# EAGLE design boards3 (EAGLE 7.0.0)
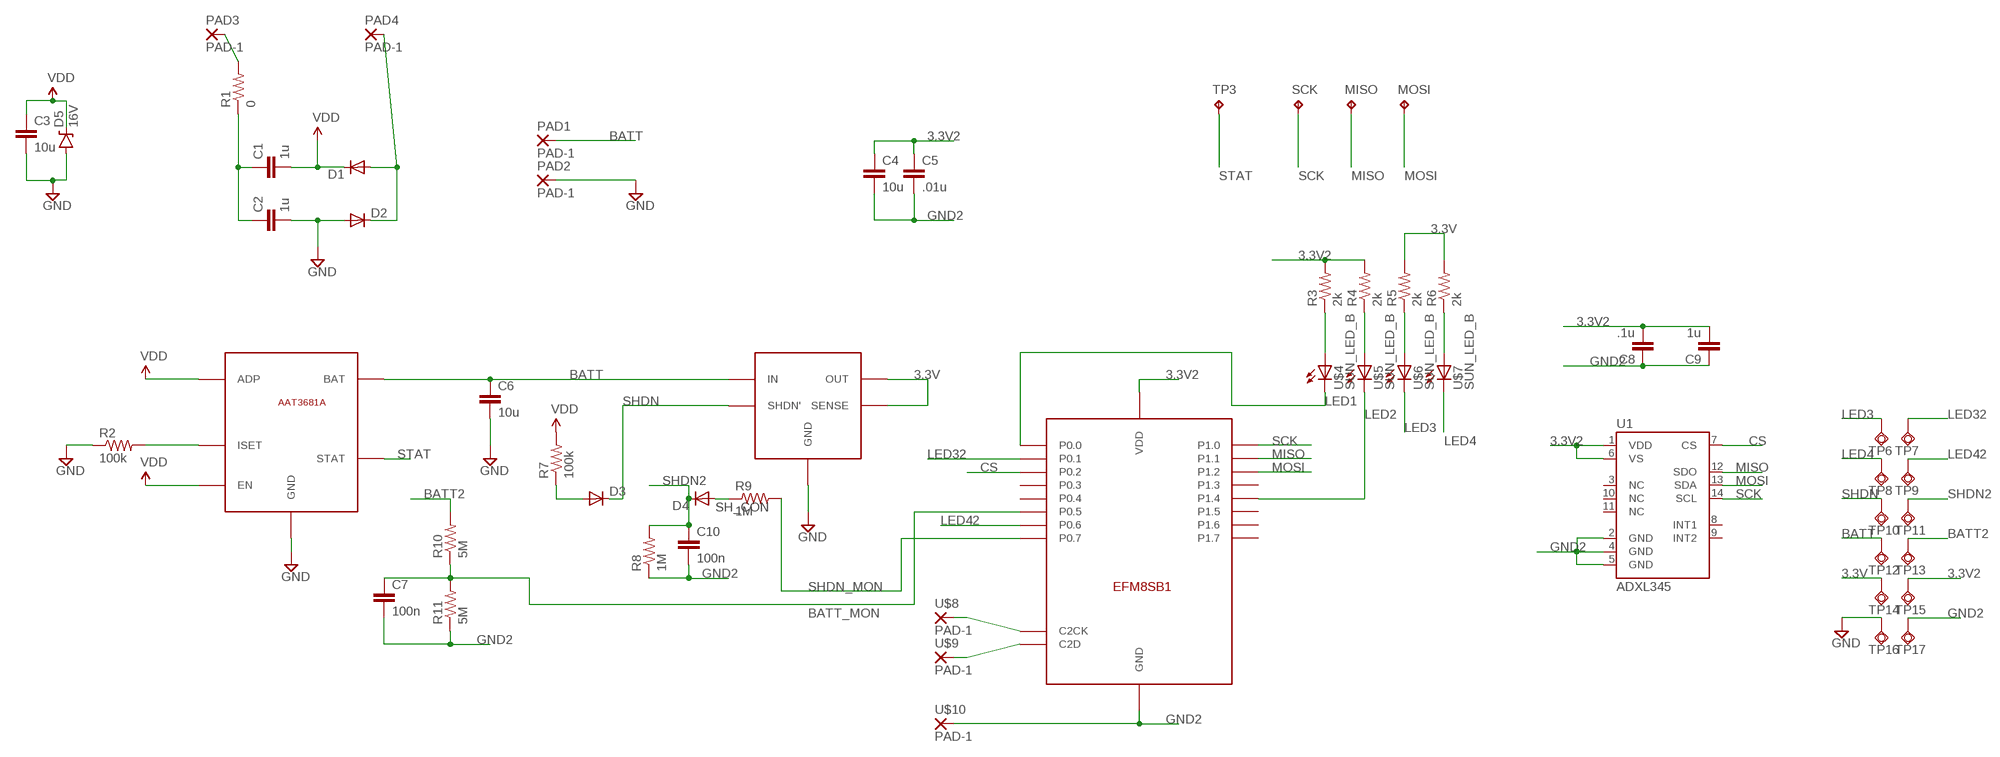
[diagram p0: schematic, sheet 1]

## Parts
C1  1u  CAP0402-CAP  [0402-CAP]
C2  1u  CAP0402-CAP  [0402-CAP]
C3  10u  CAP0603-CAP  [0603-CAP]
C4  10u  CAP0603-CAP  [0603-CAP]
C5  .01u  CAP0402-CAP  [0402-CAP]
C6  10u  CAP0603-CAP  [0603-CAP]
C7  100n  CAP0402-CAP  [0402-CAP]
C8  .1u  CAP0402-CAP  [0402-CAP]
C9  1u  CAP0402-CAP  [0402-CAP]
C10  100n  CAP0402-CAP  [0402-CAP]
D1  DIODE-SOD323-W  [SOD323-W]
D2  DIODE-SOD323-W  [SOD323-W]
D3  DIODE-SOD323-W  [SOD323-W]
D4  DIODE-SOD323-W  [SOD323-W]
D5  16V  DIODE-ZENER16V  [SOD-123]
MISO  TPB1,27  [B1,27]
MOSI  TPB1,27  [B1,27]
PAD1  PAD-1  [PAD]
PAD2  PAD-1  [PAD]
PAD3  PAD-1  [PAD]
PAD4  PAD-1  [PAD]
R1  0  RESISTOR0402-RES  [0402-RES]
R2  100k  RESISTOR0402-RES  [0402-RES]
R3  2k  RESISTOR0402-RES  [0402-RES]
R4  2k  RESISTOR0402-RES  [0402-RES]
R5  2k  RESISTOR0402-RES  [0402-RES]
R6  2k  RESISTOR0402-RES  [0402-RES]
R7  100k  RESISTOR0402-RES  [0402-RES]
R8  1M  RESISTOR0402-RES  [0402-RES]
R9  1M  RESISTOR0402-RES  [0402-RES]
R10  5M  RESISTOR0402-RES  [0402-RES]
R11  5M  RESISTOR0402-RES  [0402-RES]
SCK  TPB1,27  [B1,27]
TP3  TPB1,27  [B1,27]
TP6  TPSQB1,27  [B1,27]
TP7  TPSQB1,27  [B1,27]
TP8  TPSQB1,27  [B1,27]
TP9  TPSQB1,27  [B1,27]
TP10  TPSQB1,27  [B1,27]
TP11  TPSQB1,27  [B1,27]
TP12  TPSQB1,27  [B1,27]
TP13  TPSQB1,27  [B1,27]
TP14  TPSQB1,27  [B1,27]
TP15  TPSQB1,27  [B1,27]
TP16  TPSQB1,27  [B1,27]
TP17  TPSQB1,27  [B1,27]
U1  ADXL345  [LGA14]
U$1  AAT3681A  [SC70JW-8]
U$2  EFM8SB1  [EFM8SB1]
U$3  LT3008  [TSOT23-8]
U$4  SUN_LED_B  [1209]
U$5  SUN_LED_B  [1209]
U$6  SUN_LED_B  [1209]
U$7  SUN_LED_B  [1209]
U$8  PAD-1  [PAD]
U$9  PAD-1  [PAD]
U$10  PAD-1  [PAD]

## Nets
3.3V: R5.2 R6.2 TP14.TP U$3.6(OUT) U$3.7(SENSE)
3.3V2: C4.1 C5.1 C8.2 C9.2 R3.2 R4.2 TP15.TP U1.1(VDD) U1.6(VS) U$2.3(VDD)
BATT: C6.1 PAD1.P$1(P) TP12.TP U$1.3(BAT) U$3.5(IN)
BATT2: R10.2 TP13.TP
BATT_MON: C7.1 R10.1 R11.2 U$2.19(P0.5)
C2CK: U$2.6(C2CK) U$8.P$1(P)
C2D: U$2.7(C2D) U$9.P$1(P)
CS: U1.7(CS) U$2.22(P0.2)
GND: C2.2 C3.2 C6.2 D2.A D5.A PAD2.P$1(P) R2.1 TP16.TP U$1.6(GND) U$1.7(GND) U$1.8(GND) U$3.2(GND) U$3.3(GND) U$3.4(GND)
GND2: C4.2 C5.2 C7.2 C8.1 C9.1 C10.2 R8.1 R11.1 TP17.TP U1.2(GND) U1.4(GND) U1.5(GND) U$2.2(GND) U$10.P$1(P)
LED1: U$2.24(P0.0) U$4.C
LED2: U$2.12(P1.4) U$5.C
LED3: TP6.TP U$6.C
LED4: TP8.TP U$7.C
LED32: TP7.TP U$2.23(P0.1)
LED42: TP9.TP U$2.18(P0.6)
MISO: MISO.TP U1.12(SDO) U$2.15(P1.1)
MOSI: MOSI.TP U1.13(SDA) U$2.14(P1.2)
N$1: R2.2 U$1.2(ISET)
N$2: R3.1 U$4.A
N$3: D3.A R7.1
N$4: R4.1 U$5.A
N$10: R5.1 U$6.A
N$15: R6.1 U$7.A
N$16: C1.1 C2.1 R1.1
N$19: D1.A D2.C PAD4.P$1(P)
N$20: PAD3.P$1(P) R1.2
SCK: SCK.TP U1.14(SCL) U$2.16(P1.0)
SH_CON: D4.A R9.1
SHDN: D3.C TP10.TP U$3.1(SHDN')
SHDN2: C10.1 D4.C R8.2 TP11.TP
SHDN_MON: R9.2 U$2.17(P0.7)
STAT: TP3.TP U$1.5(STAT)
VDD: C1.2 C3.1 D1.C D5.C R7.2 U$1.1(EN) U$1.4(ADP)
Unconnected: U1.3(NC) U1.8(INT1) U1.9(INT2) U1.10(NC) U1.11(NC) U$2.8(P1.7) U$2.9(P1.6) U$2.11(P1.5) U$2.13(P1.3) U$2.20(P0.4) U$2.21(P0.3)

## Library data of the parts
C1-C10 = SparkFun-Passives:CAP: Capacitor Standard 0603 ceramic capacitor, and 0.1" leaded capacitor.
D1-D4 = diode:DIODE-: DIODE
D5 = SparkFun-DiscreteSemi:DIODE-ZENER: Zener Diode Production Part - 8199 3.4V Zener Voltage; PROD_ID: DIO-12440
MISO MOSI SCK TP3 = testpad:TP: Test pad
PAD1-PAD4 U$8-U$10 = emily-parts:PAD-1
R1-R11 = SparkFun-Passives:RESISTOR: Resistor Basic schematic elements and footprints for 0603, 1206, and PTH resistors.
TP6-TP17 = testpad:TPSQ: Test pad
U1 = SparkFun-Sensors:ADXL345: 3-axis SPI/I2C 2/4/8/16g accelerometer
U$1 = emily-parts:AAT3681A
U$2 = emily-parts:EFM8SB1
U$3 = emily-parts:LT3008
U$4-U$7 = emily-parts:SUN_LED_B

## Net classes
0 default: clearance 0.205 mm

## Board
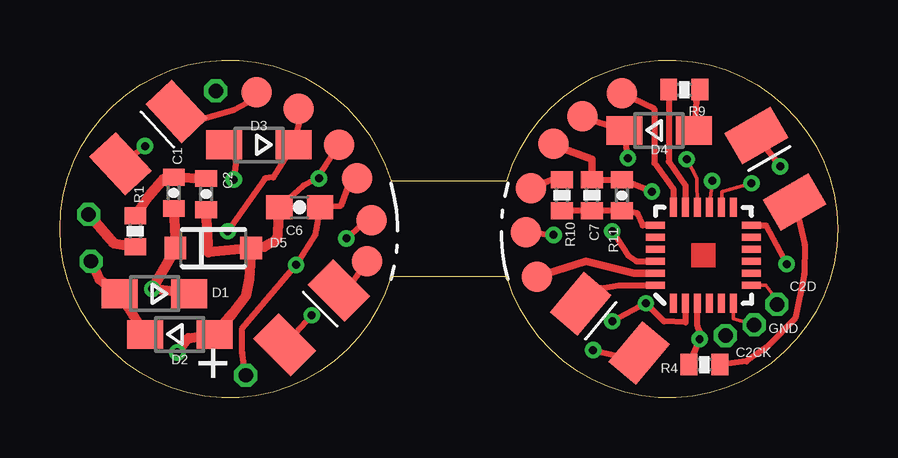
[diagram p1: board, top side]
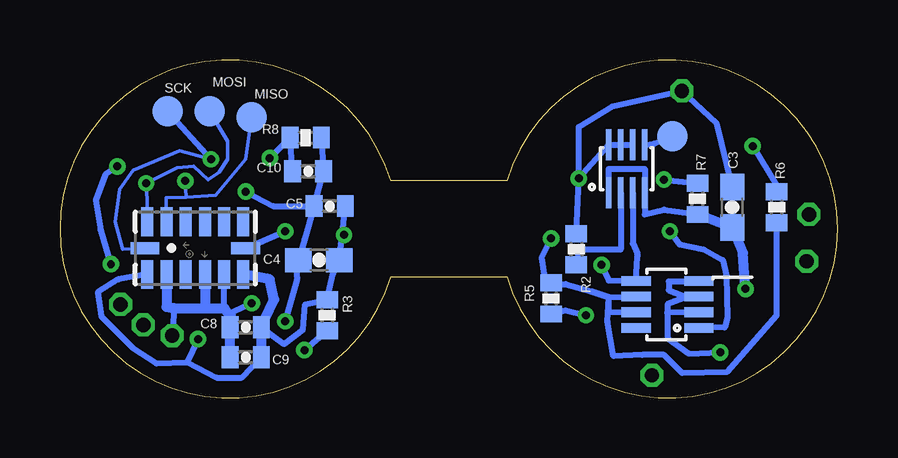
[diagram p2: board, bottom side, seen from below]

Size 32.42 x 14.07 mm. Coordinates in mm from the lower left corner, seen from the top.
Outline: 18.63,9.04 arc-327 18.63,5.04 13.79,5.04 arc-327 13.79,9.04 18.63,9.04
Copper layers (1*16): Top 0.0356mm / dielectric 1.5011mm / Bottom 0.0356mm
Design rules "LaenPCBOrder": minimum track width 6mil, minimum drill 13mil, track to track 6mil, track to pad 6mil, pad to pad 6mil, via to via 6mil, smd to smd 6mil, copper to edge 15mil, drill to drill 6mil, minimum pad ring 7mil, minimum via ring 7mil, stop-mask expansion 3mil, vias tented up to drill 0mil, thermal gap 10mil

### Footprints (pad centres in the part's own frame; a part is rotated, then mirrored left to right if it is on the bottom)
0402-CAP = smd 0.7 x 0.9: 1 -0.65,0; 2 0.65,0
0603-CAP = smd 1.1 x 1: 1 -0.85,0; 2 0.85,0
SOD323-W = smd 1.5 x 1.2: A 1.45,0; C -1.45,0
SOD-123 = smd 0.9 x 0.95: A 1.575,0; C -1.575,0
B1,27 = smd 1.27 x 1.27: TP 0,0
PAD = drill 0.6 octagon: P$1 0,0
0402-RES = smd 0.7 x 0.9: 1 -0.65,0; 2 0.65,0
LGA14 = smd 0.5 x 1.2: 1 2,1.1; 2 1.2,1.1; 3 0.4,1.1; 4 -0.4,1.1; 5 -1.2,1.1; 6 -2,1.1; 8 -2,-1.1; 9 -1.2,-1.1; 10 -0.4,-1.1; 11 0.4,-1.1; 12 1.2,-1.1; 13 2,-1.1 | smd 1.2 x 0.5: 7 -2.1,0; 14 2.1,0
SC70JW-8 = smd 0.23 x 1.3: 1 -0.75,-1; 2 -0.25,-1; 3 0.25,-1; 4 0.75,-1; 5 0.75,1; 6 0.25,1; 7 -0.25,1; 8 -0.75,1
EFM8SB1 = smd 0.8 x 0.3: 1 -2,1.25; 2 -2,0.75; 3 -2,0.25; 4 -2,-0.25; 5 -2,-0.75; 6 -2,-1.25; 13 2,-1.25; 14 2,-0.75; 15 2,-0.25; 16 2,0.25; 17 2,0.75; 18 2,1.25 | smd 0.3 x 0.8: 7 -1.25,-2; 8 -0.75,-2; 9 -0.25,-2; 10 0.25,-2; 11 0.75,-2; 12 1.25,-2; 19 1.25,2; 20 0.75,2; 21 0.25,2; 22 -0.25,2; 23 -0.75,2; 24 -1.25,2
TSOT23-8 = smd 0.4 x 1.22: 1 -0.975,-1.31; 2 -0.325,-1.31; 3 0.325,-1.31; 4 0.975,-1.31; 5 0.975,1.31; 6 0.325,1.31; 7 -0.325,1.31; 8 -0.975,1.31
1209 = smd 1.5 x 2.2: A -1.6,0; C 1.6,0

### Placement (x,y rotation side)
C1  4.74,8.54 270 top
C2  6.09,8.49 270 top
C3  4.39,7.94 90 bottom
C4  21.63,5.74 180 bottom
C5  21.18,7.99 180 bottom
C6  9.99,7.94 180 top
C7  23.43,8.44 90 top
C8  24.68,2.94 0 bottom
C9  24.68,1.69 0 bottom
C10  22.08,9.44 0 bottom
D1  3.94,4.34 180 top
D2  4.99,2.64 0 top
D3  8.29,10.54 180 top
D4  24.98,11.14 0 top
D5  6.39,6.24 0 top
MISO  24.43,11.69 0 bottom
MOSI  26.18,11.94 0 bottom
PAD1  7.74,0.94 0 top
PAD2  6.49,12.79 0 top
PAD3  1.19,7.64 0 top
PAD4  1.29,5.69 0 top
R1  3.14,6.94 270 top
R2  10.89,6.19 270 bottom
R3  21.28,3.44 90 bottom
R4  26.87,1.38 180 top
R5  11.94,4.14 90 bottom
R6  2.54,7.94 270 bottom
R7  5.84,8.29 270 bottom
R8  22.18,10.84 180 bottom
R9  26.03,12.84 180 top
R10  20.93,8.44 90 top
R11  22.18,8.44 270 top
SCK  27.93,11.94 0 bottom
TP3  6.89,10.89 0 bottom
TP6  12.79,5.69 0 top
TP7  19.88,5.04 0 top
TP8  8.19,12.74 0 top
TP9  23.43,12.69 0 top
TP10  9.94,12.04 0 top
TP11  21.78,11.74 0 top
TP12  12.39,9.14 0 top
TP13  19.63,8.74 0 top
TP14  12.99,7.39 0 top
TP15  19.43,6.89 0 top
TP16  11.64,10.54 0 top
TP17  20.58,10.59 0 top
U1  26.78,6.24 180 bottom
U$1  8.79,9.54 0 bottom
U$2  26.83,5.94 90 top
U$3  7.09,3.89 90 bottom
U$4  22.93,2.89 140 top
U$5  29.83,9.54 120 top
U$6  10.49,3.34 45 top
U$7  3.69,10.84 43 top
U$8  28.94,3.04 0 top
U$9  29.89,3.89 0 top
U$10  27.74,2.59 0 top

### Tracks (layer width: path | path; a pad name or v marks a point on that pad's centre or on a via)
3.3V  (via drill 0.33)
  Top 0.254: TP14.TP 12.54,7.19 v11.94,6.64
  Bottom 0.254: v11.94,6.64 12.34,5.84 12.17,4.73 | 12.17,4.73 11.34,4.74 10.29,4.44 | 10.29,4.44 9.53,4.19 U$3.6 | U$3.7 9.53,3.59 9.54,4.19 | R6.2 2.54,3.44 4.59,1.09 6.49,1.04 7.24,1.79 8.14,1.79 9.34,1.74 9.59,3.19 9.54,4.19 | R5.2 11.92,4.74 12.17,4.73 | 9.54,4.19 10.29,4.44
3.3V2  (via drill 0.33, 0.33 pad 0.61)
  Top 0.254: U$2.3 26.58,2.99 26.69,2.72 v26.67,2.44 R4.2 | TP15.TP v20.58,6.79
  Bottom 0.254: 20.64,6.83 C4.1 21.03,5.19 R3.2 22.19,3.89 22.29,2.84 23.08,2.24 C8.2 | 20.64,6.83 C5.1 | v20.58,6.79 20.64,6.83 | U1.1 29.99,4.94 30.84,4.39 30.69,3.39 29.39,2.09 28.39,1.44 27.12,1.48 | 27.12,1.48 25.89,0.84 24.84,0.84 C9.2 | 27.12,1.48 v26.67,2.44
  Bottom 0.406: U1.6 23.68,4.94 23.49,4.09 C8.2 C9.2
BATT  (via drill 0.33)
  Top 0.254: TP12.TP 12.04,8.94 11.69,7.99 C6.1 10.64,6.79 v9.84,5.54 7.59,2.89 7.59,1.89 PAD1.P$1
  Bottom 0.254: v9.84,5.54 9.54,4.89 U$3.5 8.35,5.88 8.35,6 8.54,6.44 U$1.3
BATT2
  Top 0.254: R10.2 20.53,9.09 TP13.TP
BATT_MON
  Top 0.254: U$2.19 24.29,7.19 24.08,7.69 C7.1 R11.2 R10.1
C2CK
  Top 0.152: U$2.6 28.08,3.3 U$8.P$1
C2D
  Top 0.152: U$2.7 29.43,4.69 29.68,4.36 U$9.P$1
CS  (via drill 0.33)
  Top 0.254: v23.03,6.94 23.68,5.94 24.04,5.69 U$2.22
  Bottom 0.254: U1.7 v23.03,6.94
GND  (via drill 0.33, 0.33 pad 0.61)
  Top 0.254: C6.2 10.14,8.84 10.76,9.18 | 10.76,9.18 TP16.TP 11.54,10.69 | 10.76,9.18 v10.79,9.14
  Top 0.406: C6.2 9.04,6.59 8.52,6.29 D5.A | v4.89,1.89 5.34,2.49 D2.A 7.19,3.51 7.74,4.24 7.89,4.96 D5.A | D5.A 6.19,6.06 C2.2
  Bottom 0.254: C3.2 5.04,11.44 PAD2.P$1 9.39,12.14 10.79,11.29 v10.79,9.14 | U$3.3 6.27,4.21 | 6.27,4.21 7.09,3.89 7.09,3.59 | 7.09,3.59 7.09,2.49 6.19,1.84 v4.89,1.89 | U$3.4 5.81,4.84 7.04,4.84 7.04,4.49 6.22,4.16 6.27,4.21 | U$3.2 7.11,3.54 7.09,3.59 | U$1.6 U$1.7 U$1.8 v10.79,9.14 | R2.1 v10.79,9.14
GND2  (via drill 0.33)
  Top 0.254: R11.1 C7.2 v24.68,8.59 | v23.03,3.19 v24.43,3.94 25.18,3.19 26.08,3.14 U$2.2
  Top 0.305: TP17.TP 20.83,10.44 22.18,9.94 R11.1
  Bottom 0.254: v24.68,8.59 23.53,7.99 C5.2 | R8.1 C10.2 C5.2 | C5.2 22.23,6.59 C4.2 22.58,5.34 22.54,4.94 v23.03,3.19 | 25.58,3.74 U1.5 | v24.43,3.94 25.18,3.59 C8.1 25.18,3.19 | 27.67,3.73 U$10.P$1
  Bottom 0.406: U1.2 27.98,3.79 27.67,3.73 26.38,3.74 | U1.4 26.38,3.74 | 26.38,3.74 25.58,3.74 25.18,3.19 | C9.1 C8.1
LED1
  Top 0.254: U$4.C 22.56,4.57 23.29,4.69 U$2.24
LED2  (via drill 0.33)
  Top 0.254: U$5.C v30.03,9.64 | U$2.12 29.43,7.19 v30.3,5.56
  Bottom 0.254: v30.03,9.64 30.53,9.29 30.93,8.24 30.73,6.99 v30.3,5.56
LED3
  Top 0.254: TP6.TP 12.17,4.77 U$6.C
LED4
  Top 0.254: TP8.TP 8.54,12.69 7.24,11.99 5.86,11.59 U$7.C
LED32
  Top 0.305: U$2.23 23.93,5.19 21.93,5.69 TP7.TP
LED42
  Top 0.254: TP9.TP 24.78,12.04 24.78,9.79 25.58,8.69 U$2.18
MISO  (via drill 0.33 pad 0.61)
  Top 0.152: U$2.15 v27.19,9.04
  Bottom 0.152: U1.12 28,8.32 27.16,8.36 | MISO.TP 24.68,9.94 25.93,8.44 27.16,8.36 | v27.19,9.04 27.16,8.36
MOSI  (via drill 0.33)
  Top 0.152: U$2.14 27.59,8.59 v28.83,8.94
  Bottom 0.152: MOSI.TP 25.43,10.69 25.43,9.94 25.78,9.39 26.24,9.09 26.84,9.64 27.54,9.59 v28.83,8.94 28.79,8.24 U1.13
N$1
  Bottom 0.254: R2.2 10.74,6.19 9.04,6.19 U$1.2
N$2  (via drill 0.33)
  Top 0.254: v22.23,1.99 23.53,1.69 U$4.A
  Bottom 0.254: R3.1 v22.23,1.99
N$3  (via drill 0.33)
  Top 0.254: D3.A 7.34,9.89 v7.24,9.09
  Bottom 0.254: v7.24,9.09 R7.1
N$4
  Top 0.254: U$5.A 31.05,6.36 31.02,5.16 30.66,3.32 29.5,2.14 28.62,1.52 R4.1
N$10  (via drill 0.33)
  Top 0.254: U$6.A v10.49,3.44
  Bottom 0.254: R5.1 11.34,3.64 v10.49,3.44
N$15  (via drill 0.33)
  Top 0.254: U$7.A v3.54,10.49
  Bottom 0.254: v3.54,10.49 2.54,8.84 R6.1
N$16
  Top 0.406: R1.1 3.69,8.39 4.34,9.14 C1.1 C2.1
N$19
  Top 0.406: PAD4.P$1 1.64,4.94 D1.A D2.C
N$20
  Top 0.406: PAD3.P$1 2.24,6.44 R1.2
SCK  (via drill 0.33)
  Top 0.152: U$2.16 26.54,9.14 v26.13,9.94
  Bottom 0.152: v26.13,9.94 27.43,10.29 29.38,9.49 29.93,8.69 30.13,7.34 29.8,6.19 U1.14
  Bottom 0.254: SCK.TP v26.13,9.94
SH_CON
  Top 0.254: R9.1 26.53,12.34 D4.A
SHDN  (via drill 0.33)
  Top 0.254: TP10.TP 9.99,11.59 D3.C 8.89,9.19 8.54,9.14 v6.99,6.94
  Bottom 0.254: v6.99,6.94 6.59,6.39 5.59,6.19 4.79,5.74 4.64,5.09 4.59,3.34 4.71,2.94 U$3.1
SHDN2  (via drill 0.33)
  Top 0.254: TP11.TP 21.68,11.74 D4.C v23.68,9.99
  Bottom 0.254: v23.68,9.99 R8.2 C10.1
SHDN_MON
  Top 0.254: R9.2 25.38,9.84 26.08,8.84 U$2.17
STAT
  Bottom 0.254: U$1.5 7.64,10.59 7.14,10.84 TP3.TP
VDD  (via drill 0.33 pad 0.61)
  Top 0.406: D1.C v3.84,4.54 D5.C C1.2
  Bottom 0.254: U$1.1 9.54,9.54 8.04,9.54 U$1.4 8.04,7.64 7.24,7.84 R7.2
  Bottom 0.406: v3.84,4.54 3.94,6.04 C3.1 R7.2

### Text on the board
tNames: C2D | GND | C2CK | +
bValues: LED4 | STAT | SHDN | GND | BATT | COIL | 3.3V | LED3